# Altium schematic sheet 1.POWER.SchDoc
size A4
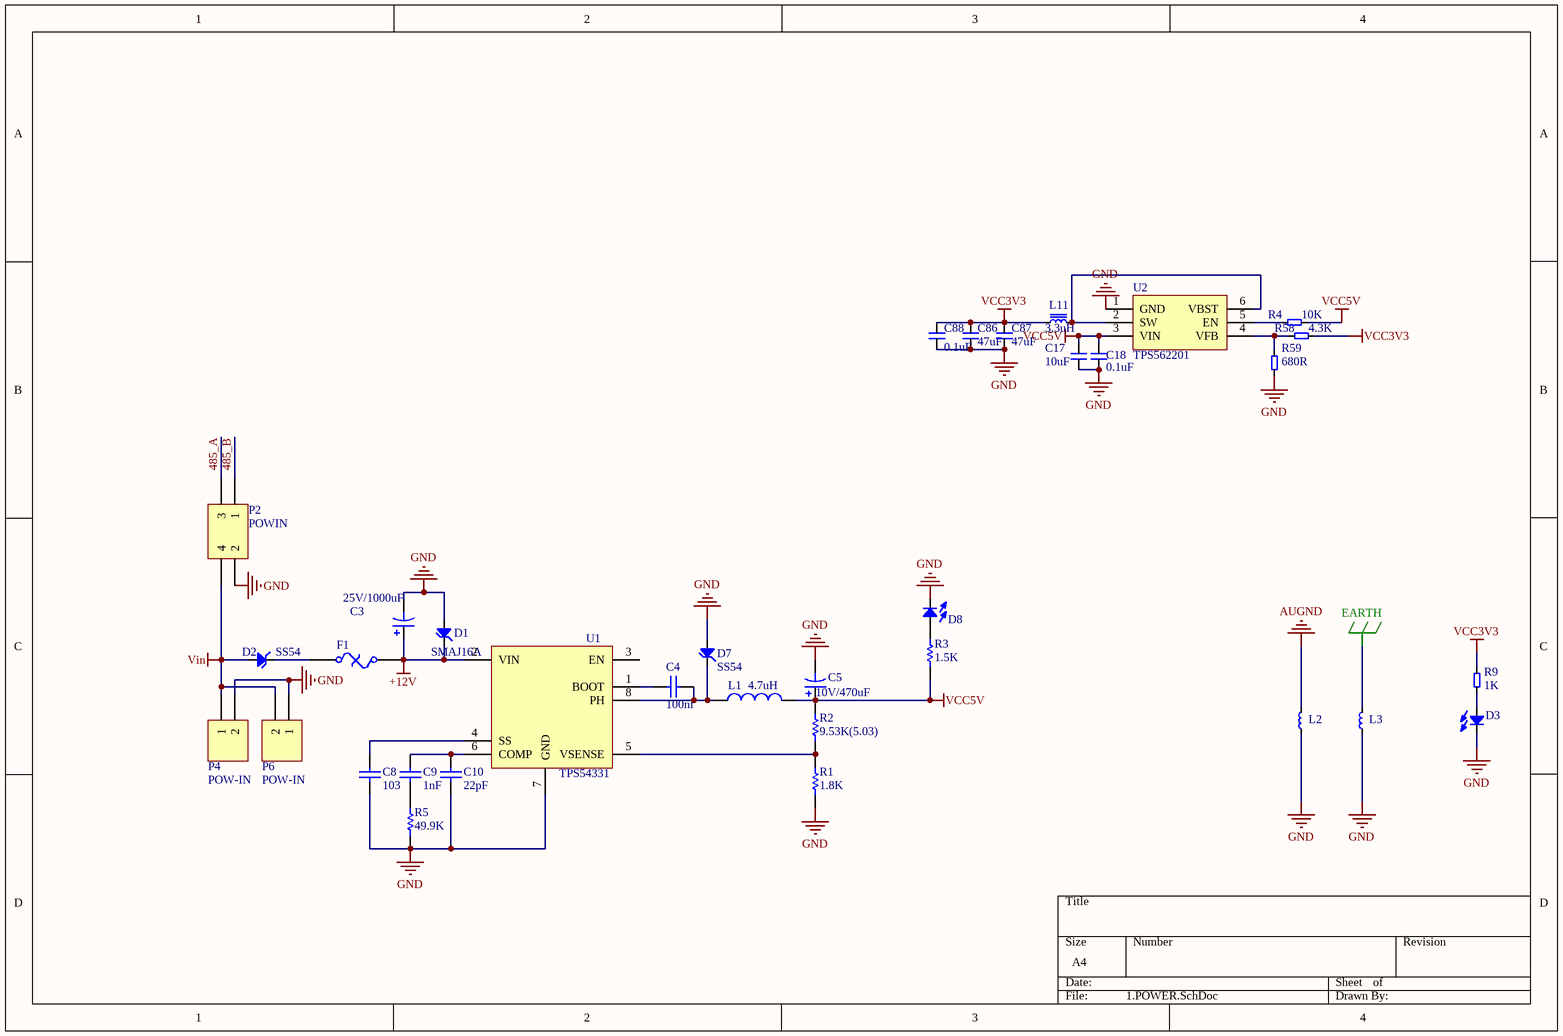
[diagram p0: 1.POWER.SchDoc]

## Parts
C3  value 25V/1000uF  [C10-SMD]  (hidden comment: Cap Pol3)
C4  value 100nf  [0603C]  (hidden comment: Cap)
C5  value 10V/470uF  [C8x10-SMD]  (hidden comment: Cap Pol3)
C8  value 103  [0603C]  (hidden comment: Cap)
C9  value 1nF  [0603C]  (hidden comment: Cap)
C10  value 22pF  [0603C]  (hidden comment: Cap)
C17  10uF  [0603C]
C18  0.1uF  [0603C]
C86  47uF  [C1206]
C87  47uF  [C1206]
C88  0.1uF  [0603C]
D1  SMAJ16A  [SMA]
D2  SS54  [SMA]
D3  发光二极管  [0603D]  (value not drawn)
D7  SS54  [SMA]
D8  发光二极管  [0603D]  (value not drawn)
F1  Fuse Thermal  [1812F]  (value not drawn)
L1  value 4.7uH  [L-6045]  (hidden comment: Inductor)
L2  电感  [0805L]  (value not drawn)
L3  电感  [0805L]  (value not drawn)
L11  3.3uH  [L4030]
P2  POWIN  [5569]
P4  POW-IN  [VH3.96-2P-SMT]
P6  POW-IN  [DC-5525]
R1  value 1.8K  [0603R]  (hidden comment: Res Semi)
R2  value 9.53K(5.03)  [0603R]  (hidden comment: Res Semi)
R3  value 1.5K  [0603R]  (hidden comment: Res1)
R4  10K  [0603R]
R5  value 49.9K  [0603R]  (hidden comment: Res Semi)
R9  1K  [0603R]
R58  4.3K  [0603R]
R59  680R  [0603R]
U1  TPS54331  [SOP8-POW]
U2  TPS562201  [SOT23-6-DC]

## Nets
+12V: C3.1 D1.K F1.2 U1.2(VIN)
AUGND: L2.2
EARTH: L3.2 P4.0
GND: C3.2 C5.2 C8.2 C10.1 C17.2 C18.2 C86.2 C87.2 C88.2 D1.A D3.K D7.A D8.K L2.1 L3.1 P2.2 P4.2 P6.1 R1.1 R5.1 R59.1 U1.7(GND) U1.9 U2.1(GND)
VCC3V3: C86.1 C87.1 C88.1 L11.1 R9.2 R58.1
VCC5V: C5.1 C17.1 C18.1 L1.2 R2.2 R3.1 R4.1 U2.3(VIN)
Vin: D2.A P2.4 P4.1 P6.2
485_A: P2.3
485_B: P2.1
NetC4_1: C4.1 D7.K L1.1 U1.8(PH)
NetC4_2: C4.2 U1.1(BOOT)
NetC8_1: C8.1 U1.4(SS)
NetC9_1: C9.1 R5.2
NetC9_2: C9.2 C10.2 U1.6(COMP)
NetD2_K: D2.K F1.1
NetD3_A: D3.A R9.1
NetD8_A: D8.A R3.2
NetL11_2: L11.2 U2.2(SW) U2.6(VBST)
NetR1_2: R1.2 R2.1 U1.5(VSENSE)
NetR4_2: R4.2 U2.5(EN)
NetR58_2: R58.2 R59.2 U2.4(VFB)

Not connected (* = marked no-connect by the designer): U1 3(EN)

## Library data of the parts
C3 C5 = Cap Pol3: Polarized Capacitor (Surface Mount); Published: 8-Jun-2000; LatestRevisionDate: 17-Jul-2002; LatestRevisionNote: Re-released for DXP Platform.; PackageReference: C0805; Publisher: Altium Limited
C4 C8-C10 = Cap: Capacitor; Published: 8-Jun-2000; LatestRevisionDate: 17-Jul-2002; LatestRevisionNote: Re-released for DXP Platform.; PackageReference: RAD-0.3; Publisher: Altium Limited
  C8-C10: PackageDescription: Radial Cap, Thru-Hole; 2 Leads; 0.3 in Pin Spacing
C17 C18 C86-C88 = 电容
D1 D2 D7 = SS24: DIODES: *
F1 = Fuse Thermal: Thermal Fuse; Published: 24-Mar-1999; LatestRevisionDate: 17-Jul-2002; LatestRevisionNote: Re-released for DXP Platform.; PackageReference: PIN-W2/E2.8; Publisher: Altium Limited
L1 = Inductor: Code_IEC: 1005; Published: 8-Jun-2000; LatestRevisionDate: 17-Jul-2002; LatestRevisionNote: Re-released for DXP Platform.; PackageReference: 0402-A; Publisher: Altium Limited; Code_JEITA: 0402
L11 = 功率电感
P2 = Header 2X2: Header, 2-Pin, Dual row; LatestRevisionDate: 17-Jul-2002; LatestRevisionNote: Re-released for DXP Platform.; Publisher: Altium Limited
P4 P6 = Header 2: Header, 2-Pin; LatestRevisionDate: 17-Jul-2002; LatestRevisionNote: Re-released for DXP Platform.; Publisher: Altium Limited
R1 R2 R5 = Res Semi: Semiconductor Resistor; Published: 8-Jun-2000; LatestRevisionDate: 17-Jul-2002; LatestRevisionNote: Re-released for DXP Platform.; PackageReference: AXIAL-0.5; Publisher: Altium Limited; PackageDescription: Axial Device, Thru-Hole; 2 Leads; 0.5 in Pin Spacing
R3 = Res1: Resistor; Published: 8-Jun-2000; LatestRevisionDate: 17-Jul-2002; LatestRevisionNote: Re-released for DXP Platform.; PackageReference: AXIAL-0.3; Publisher: Altium Limited
R4 R9 R58 R59 = 电阻